# EAGLE schematic STM32-E407_Rev_B1 (EAGLE 9.6.2)
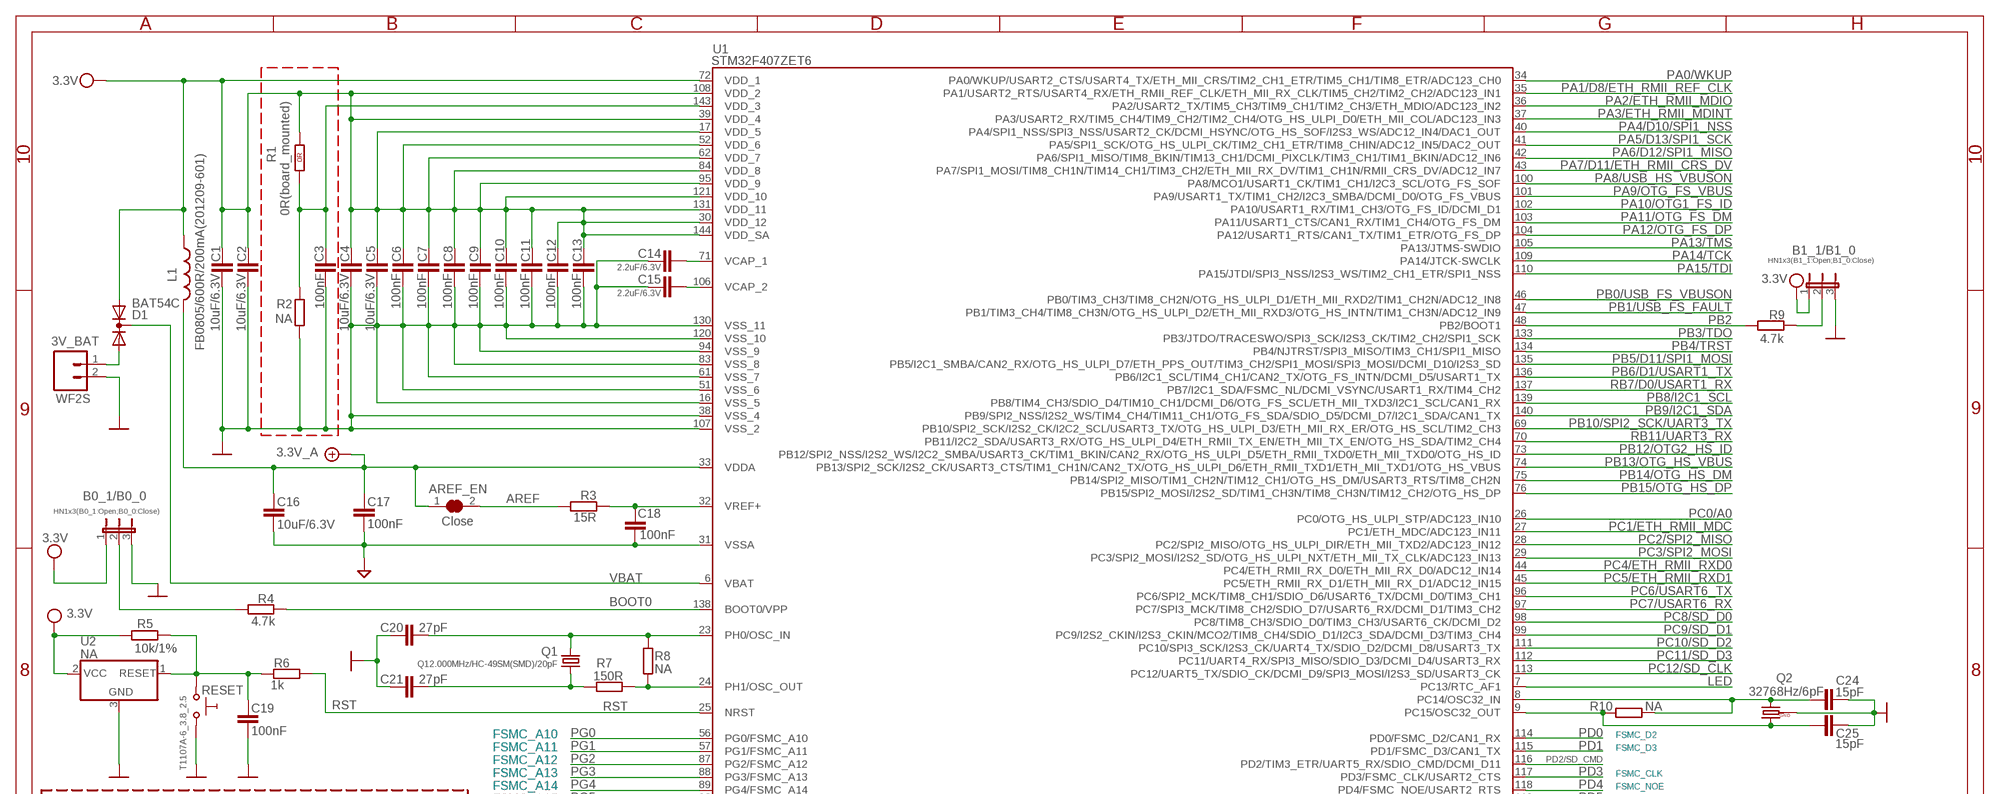
[diagram p0: schematic, sheet 1, part 1 of 2]
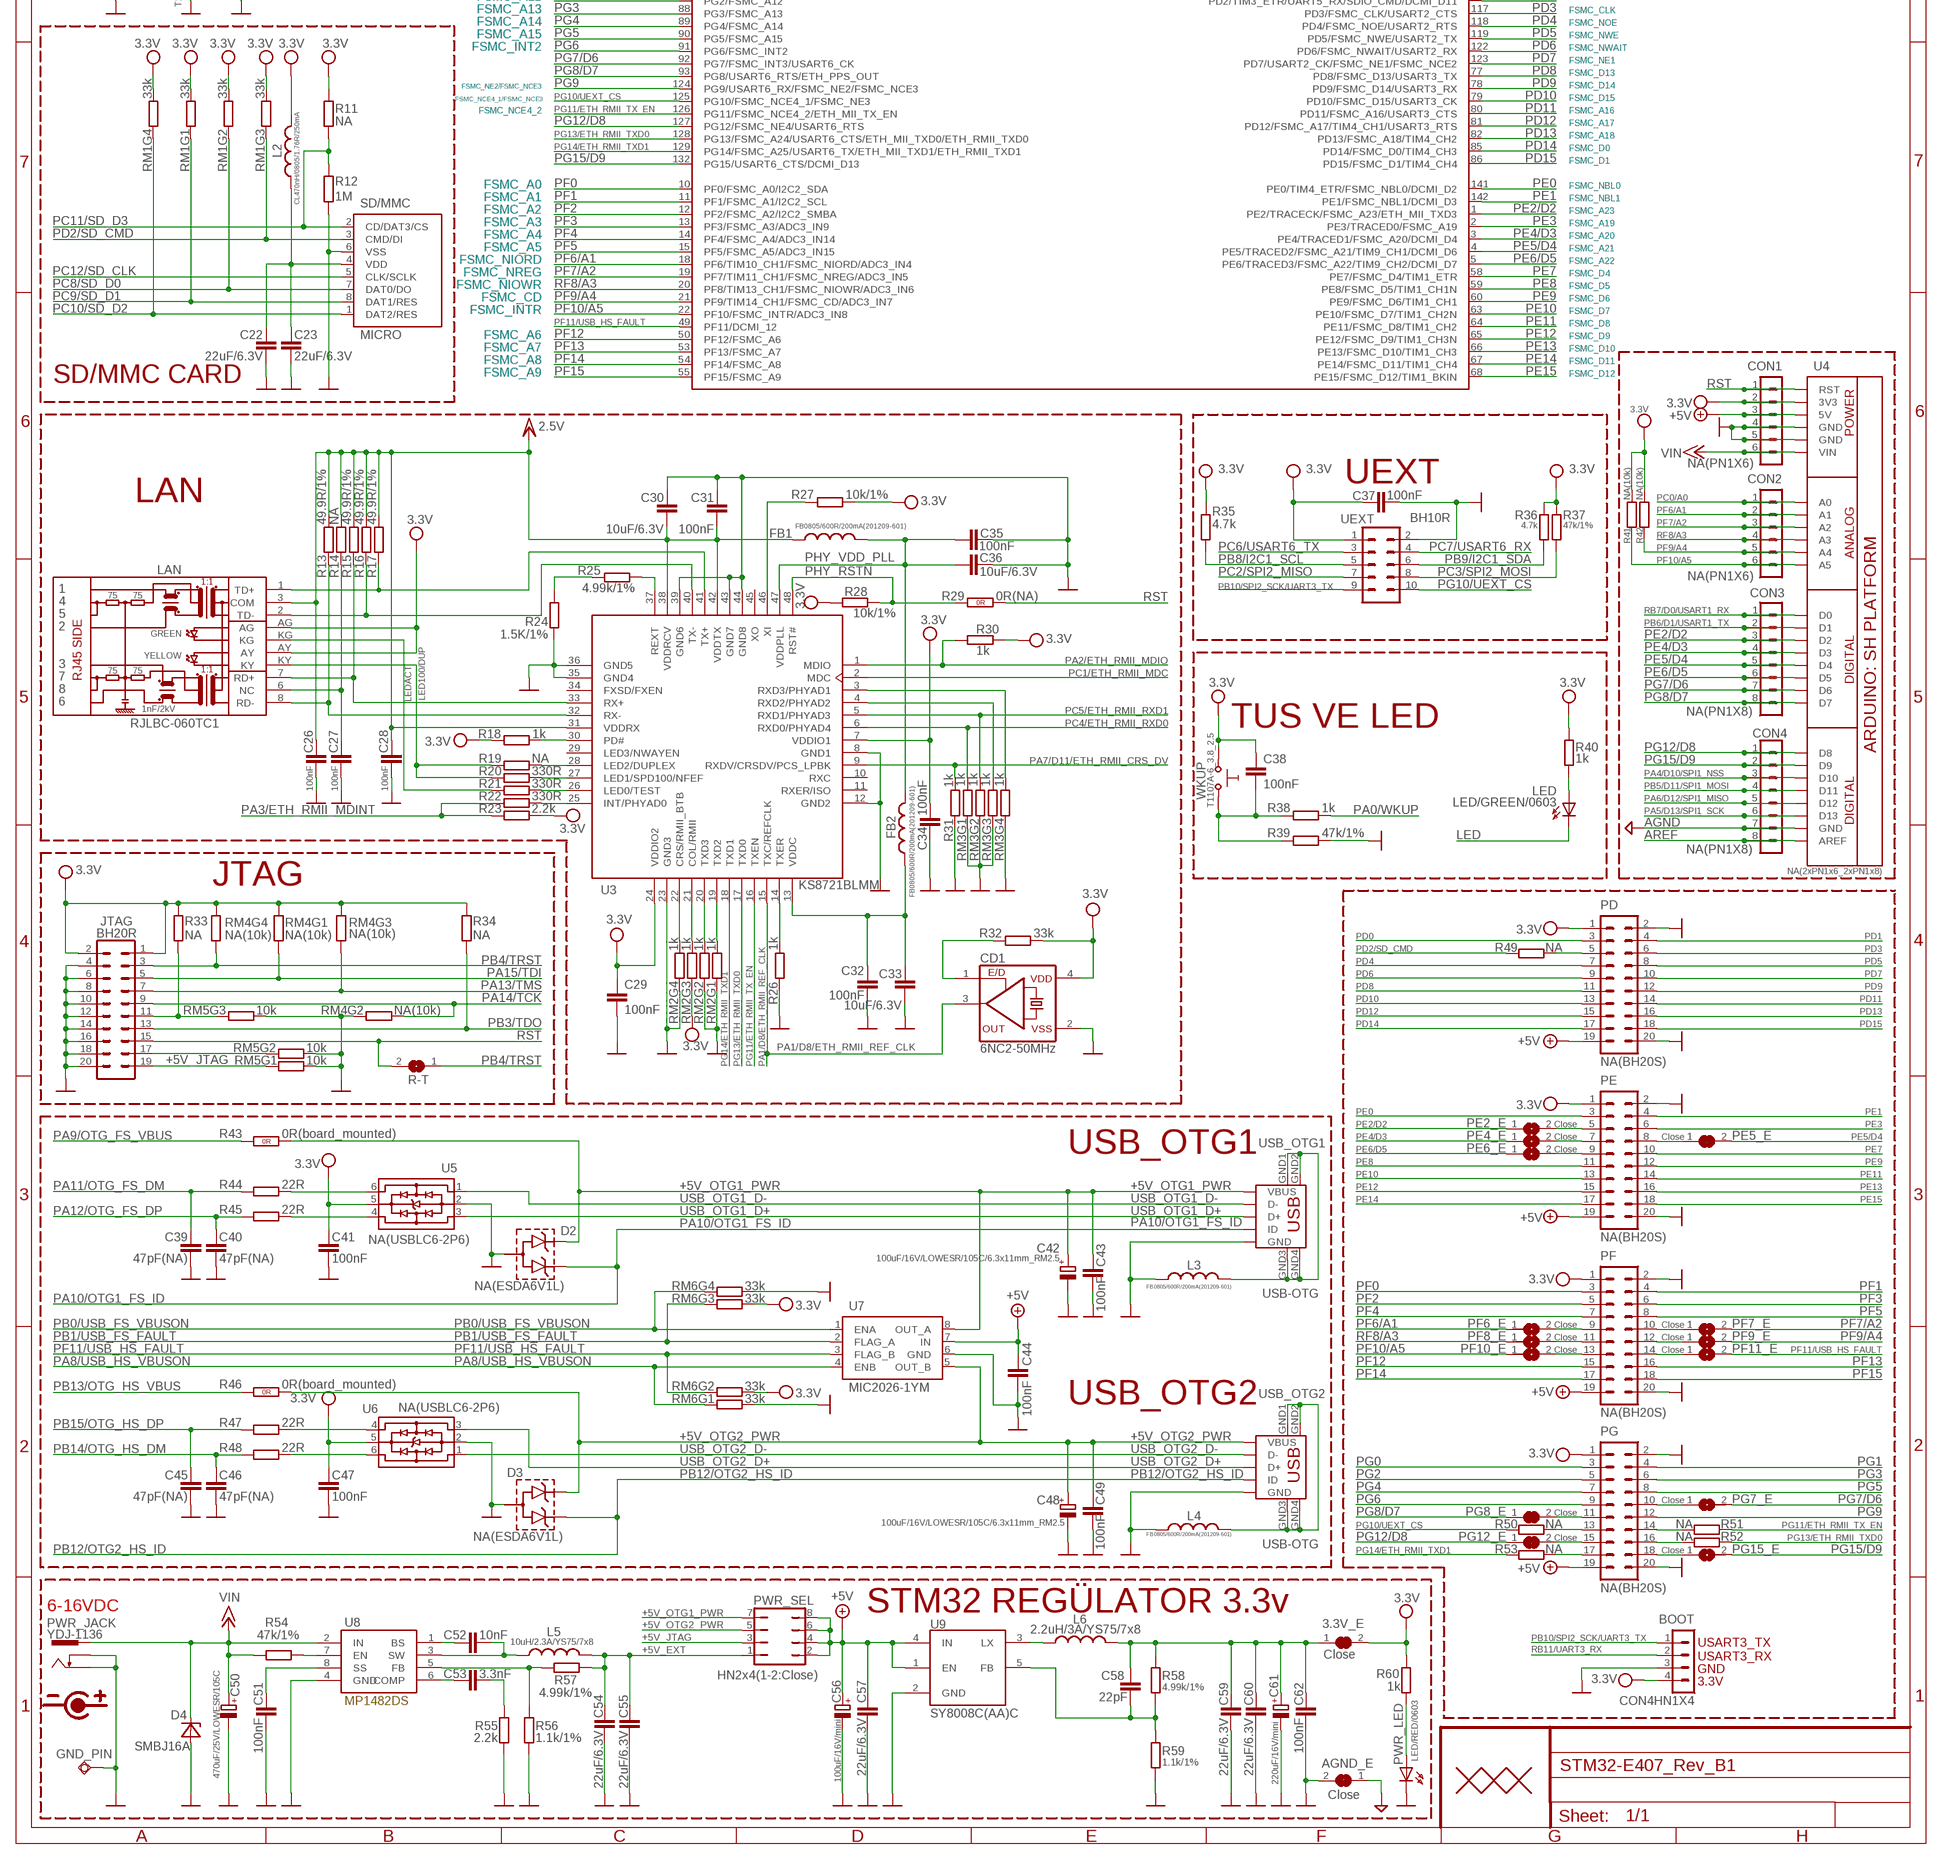
[diagram p1: schematic, sheet 1, part 2 of 2]

## Parts
3.3V_E  Close  SJSJ_1_SMALLER_CLOSE  [SJ_1_SMALLER_CLOSE]
3V_BAT  WF2S  CON2PV2-2.54MM  [CON2.54MM-2-0]
AGND_E  Close  SJSJ_1_SMALLER_CLOSE  [SJ_1_SMALLER_CLOSE]
AREF_EN  Close  SJSJ_1_SMALLER_CLOSE  [SJ_1_SMALLER_CLOSE]
B0_1/B0_0  HN1x3(B0_1:Open;B0_0:Close)  JP2E  [JP2]
B1_1/B1_0  HN1x3(B1_1:Open;B1_0:Close)  JP2E  [JP2]
BOOT  CON4HN1X4  [HN1X4]
C1  10uF/6.3V  C-EUC0603_DWS  [C0603_DWS]
C2  10uF/6.3V  C-EUC0603_DWS  [C0603_DWS]
C3  100nF  C-EUC0603_DWS  [C0603_DWS]
C4  10uF/6.3V  C-EUC0603_DWS  [C0603_DWS]
C5  10uF/6.3V  C-EUC0603_DWS  [C0603_DWS]
C6  100nF  C-EUC0603_DWS  [C0603_DWS]
C7  100nF  C-EUC0603_DWS  [C0603_DWS]
C8  100nF  C-EUC0603_DWS  [C0603_DWS]
C9  100nF  C-EUC0603_DWS  [C0603_DWS]
C10  100nF  C-EUC0603_DWS  [C0603_DWS]
C11  100nF  C-EUC0603_DWS  [C0603_DWS]
C12  100nF  C-EUC0603_DWS  [C0603_DWS]
C13  100nF  C-EUC0603_DWS  [C0603_DWS]
C14  2.2uF/6.3V  C-EUC0603_DWS  [C0603_DWS]
C15  2.2uF/6.3V  C-EUC0603_DWS  [C0603_DWS]
C16  10uF/6.3V  C-EUC0603_DWS  [C0603_DWS]
C17  100nF  C-EUC0603_DWS  [C0603_DWS]
C18  100nF  C-EUC0603_DWS  [C0603_DWS]
C19  100nF  C-EUC0603_DWS  [C0603_DWS]
C20  27pF  C-EUC0603_DWS  [C0603_DWS]
C21  27pF  C-EUC0603_DWS  [C0603_DWS]
C22  22uF/6.3V  C-EUC0603_DWS  [C0603_DWS]
C23  22uF/6.3V  C-EUC0603_DWS  [C0603_DWS]
C24  15pF  C-EUC0603_DWS  [C0603_DWS]
C25  15pF  C-EUC0603_DWS  [C0603_DWS]
C26  100nF  C-EUC0603_DWS  [C0603_DWS]
C27  100nF  C-EUC0603_DWS  [C0603_DWS]
C28  100nF  C-EUC0603_DWS  [C0603_DWS]
C29  100nF  C-EUC0603_DWS  [C0603_DWS]
C30  10uF/6.3V  C-EUC0603_DWS  [C0603_DWS]
C31  100nF  C-EUC0603_DWS  [C0603_DWS]
C32  100nF  C-EUC0603_DWS  [C0603_DWS]
C33  10uF/6.3V  C-EUC0603_DWS  [C0603_DWS]
C34  100nF  C-EUC0603_DWS  [C0603_DWS]
C35  100nF  C-EUC0603_DWS  [C0603_DWS]
C36  10uF/6.3V  C-EUC0603_DWS  [C0603_DWS]
C37  100nF  C-EUC0603_DWS  [C0603_DWS]
C38  100nF  C-EUC0603_DWS  [C0603_DWS]
C39  47pF(NA)  C-EUC0603_DWS  [C0603_DWS]
C40  47pF(NA)  C-EUC0603_DWS  [C0603_DWS]
C41  100nF  C-EUC0603_DWS  [C0603_DWS]
C42  100uF/16V/LOWESR/105C/6.3x11mm_RM2.5  CPOL-EUE2.5-6.3  [E2,5-6,3]
C43  100nF  C-EUC0603_DWS  [C0603_DWS]
C44  100nF  C-EUC0603_DWS  [C0603_DWS]
C45  47pF(NA)  C-EUC0603_DWS  [C0603_DWS]
C46  47pF(NA)  C-EUC0603_DWS  [C0603_DWS]
C47  100nF  C-EUC0603_DWS  [C0603_DWS]
C48  100uF/16V/LOWESR/105C/6.3x11mm_RM2.5  CPOL-EUE2.5-6.3  [E2,5-6,3]
C49  100nF  C-EUC0603_DWS  [C0603_DWS]
C50  470uF/25V/LOWESR/105C  CPOL-EUE5-10.5  [E5-10,5]
C51  100nF  C-EUC0603_DWS  [C0603_DWS]
C52  10nF  C-EUC0603_DWS  [C0603_DWS]
C53  3.3nF  C-EUC0603_DWS  [C0603_DWS]
C54  22uF/6.3V  C-EUC0603_DWS  [C0603_DWS]
C55  22uF/6.3V  C-EUC0603_DWS  [C0603_DWS]
C56  100uF/16V/mini  CPOL-EUE2.5-6  [E2,5-6]
C57  22uF/6.3V  C-EUC0603_DWS  [C0603_DWS]
C58  22pF  C-EUC0603_DWS  [C0603_DWS]
C59  22uF/6.3V  C-EUC0603_DWS  [C0603_DWS]
C60  22uF/6.3V  C-EUC0603_DWS  [C0603_DWS]
C61  220uF/16V/mini  CPOL-EUE3.5-8  [E3,5-8]
C62  100nF  C-EUC0603_DWS  [C0603_DWS]
CD1  6NC2-50MHz  6NC2_CLOCK_DRIVER  [7X5MM_CLOCK_DRIVER]
CON1  NA(PN1X6)  CON6PN1X6  [PN1X6]
CON2  NA(PN1X6)  CON6PN1X6  [PN1X6]
CON3  NA(PN1X8)  CON8PN1X8  [PN1X8]
CON4  NA(PN1X8)  CON8PN1X8  [PN1X8]
D1  BAT54C  DIODE_AC-CA_  [SOT23C]
D2  NA(ESDA6V1L)  MMBZ5V6ALT1  [SOT-23]
D3  NA(ESDA6V1L)  MMBZ5V6ALT1  [SOT-23]
D4  SMBJ16A  [DO214AA]
FB1  FB0805/600R/200mA(201209-601)  L-USL0805_5MIL_DWS  [L0805_5MIL_DWS]
FB2  FB0805/600R/200mA(201209-601)  L-USL0805_5MIL_DWS  [L0805_5MIL_DWS]
GND_PIN  TESTPAD3  [TEST_PAD40/70/SQUARE]
JTAG  BH20R  ML20R  [BH20R]
L1  FB0805/600R/200mA(201209-601)  L-USL0805_5MIL_DWS  [L0805_5MIL_DWS]
L2  CL470nH/0805/1.76R/250mA  L-USL0805_5MIL_DWS  [L0805_5MIL_DWS]
L3  FB0805/600R/200mA(201209-601)  L-USL0805_5MIL_DWS  [L0805_5MIL_DWS]
L4  FB0805/600R/200mA(201209-601)  L-USL0805_5MIL_DWS  [L0805_5MIL_DWS]
L5  10uH/2.3A/YS75/7x8  L-USL7078  [L7078]
L6  2.2uH/3A/YS75/7x8  L-USL7078  [L7078]
LAN  RJLBC-060TC1  [RJLBC-060TC1]
LED  LED/GREEN/0603  LED0603DWS  [LED-0603]
PD  NA(BH20S)  ML20  [ML20-MALE]
PE  NA(BH20S)  ML20  [ML20-MALE]
PE2_E  Close  SJSJ_1_SMALLER_CLOSE  [SJ_1_SMALLER_CLOSE]
PE4_E  Close  SJSJ_1_SMALLER_CLOSE  [SJ_1_SMALLER_CLOSE]
PE5_E  Close  SJSJ_1_SMALLER_CLOSE  [SJ_1_SMALLER_CLOSE]
PE6_E  Close  SJSJ_1_SMALLER_CLOSE  [SJ_1_SMALLER_CLOSE]
PF  NA(BH20S)  ML20  [ML20-MALE]
PF6_E  Close  SJSJ_1_SMALLER_CLOSE  [SJ_1_SMALLER_CLOSE]
PF7_E  Close  SJSJ_1_SMALLER_CLOSE  [SJ_1_SMALLER_CLOSE]
PF8_E  Close  SJSJ_1_SMALLER_CLOSE  [SJ_1_SMALLER_CLOSE]
PF9_E  Close  SJSJ_1_SMALLER_CLOSE  [SJ_1_SMALLER_CLOSE]
PF10_E  Close  SJSJ_1_SMALLER_CLOSE  [SJ_1_SMALLER_CLOSE]
PF11_E  Close  SJSJ_1_SMALLER_CLOSE  [SJ_1_SMALLER_CLOSE]
PG  NA(BH20S)  ML20  [ML20-MALE]
PG7_E  Close  SJSJ_1_SMALLER_CLOSE  [SJ_1_SMALLER_CLOSE]
PG8_E  Close  SJSJ_1_SMALLER_CLOSE  [SJ_1_SMALLER_CLOSE]
PG12_E  Close  SJSJ_1_SMALLER_CLOSE  [SJ_1_SMALLER_CLOSE]
PG15_E  Close  SJSJ_1_SMALLER_CLOSE  [SJ_1_SMALLER_CLOSE]
PWR_JACK  YDJ-1136  PWR-JAKPWR_JACK_UNI_MILLING  [PWR_JACK_UNI_MILLING]
PWR_LED  LED/RED/0603  LED0603DWS  [LED-0603]
PWR_SEL  HN2x4(1-2:Close)  JP4QNEW  [JP4Q_2]
Q1  Q12.000MHz/HC-49SM(SMD)/20pF  HC49/S1  [HC49/SMD2_THIN]
Q2  32768Hz/6pF  Q_GND1  [TC26H_3_REPAIR_SMD]
R1  0R(board_mounted)  R_0R0R(NA)  [0603_0R]
R2  NA  R-EU_R0603_5MIL_DWS_NA  [R0603_5MIL_DWS_NA]
R3  15R  R-EU_R0603_5MIL_DWS  [R0603_5MIL_DWS]
R4  4.7k  R-EU_R0603_5MIL_DWS  [R0603_5MIL_DWS]
R5  10k/1%  R-EU_R0603_5MIL_DWS  [R0603_5MIL_DWS]
R6  1k  R-EU_R0603_5MIL_DWS  [R0603_5MIL_DWS]
R7  150R  R-EU_R0603_5MIL_DWS  [R0603_5MIL_DWS]
R8  NA  R-EU_R0603_5MIL_DWS_NA  [R0603_5MIL_DWS_NA]
R9  4.7k  R-EU_R0603_5MIL_DWS  [R0603_5MIL_DWS]
R10  NA  R-EU_R0603_5MIL_DWS_NA  [R0603_5MIL_DWS_NA]
R11  NA  R-EU_R0603_5MIL_DWS_NA  [R0603_5MIL_DWS_NA]
R12  1M  R-EU_R0603_5MIL_DWS  [R0603_5MIL_DWS]
R13  49.9R/1%  R-EU_R0603_5MIL_DWS  [R0603_5MIL_DWS]
R14  NA  R-EU_R0603_5MIL_DWS_NA  [R0603_5MIL_DWS_NA]
R15  49.9R/1%  R-EU_R0603_5MIL_DWS  [R0603_5MIL_DWS]
R16  49.9R/1%  R-EU_R0603_5MIL_DWS  [R0603_5MIL_DWS]
R17  49.9R/1%  R-EU_R0603_5MIL_DWS  [R0603_5MIL_DWS]
R18  1k  R-EU_R0603_5MIL_DWS  [R0603_5MIL_DWS]
R19  NA  R-EU_R0603_5MIL_DWS_NA  [R0603_5MIL_DWS_NA]
R20  330R  R-EU_R0603_5MIL_DWS  [R0603_5MIL_DWS]
R21  330R  R-EU_R0603_5MIL_DWS  [R0603_5MIL_DWS]
R22  330R  R-EU_R0603_5MIL_DWS  [R0603_5MIL_DWS]
R23  2.2k  R-EU_R0603_5MIL_DWS  [R0603_5MIL_DWS]
R24  1.5K/1%  R-EU_R0603_5MIL_DWS  [R0603_5MIL_DWS]
R25  4.99k/1%  R-EU_R0603_5MIL_DWS  [R0603_5MIL_DWS]
R26  1k  R-EU_R0603_5MIL_DWS  [R0603_5MIL_DWS]
R27  10k/1%  R-EU_R0603_5MIL_DWS  [R0603_5MIL_DWS]
R28  10k/1%  R-EU_R0603_5MIL_DWS  [R0603_5MIL_DWS]
R29  0R(NA)  R_0R0R(NA)  [0603_0R]
R30  1k  R-EU_R0603_5MIL_DWS  [R0603_5MIL_DWS]
R31  1k  R-EU_R0603_5MIL_DWS  [R0603_5MIL_DWS]
R32  33k  R-EU_R0603_5MIL_DWS  [R0603_5MIL_DWS]
R33  NA  R-EU_R0603_5MIL_DWS_NA  [R0603_5MIL_DWS_NA]
R34  NA  R-EU_R0603_5MIL_DWS_NA  [R0603_5MIL_DWS_NA]
R35  4.7k  R-EU_R0603_5MIL_DWS  [R0603_5MIL_DWS]
R36  4.7k  R-EU_R0603_5MIL_DWS  [R0603_5MIL_DWS]
R37  47k/1%  R-EU_R0603_5MIL_DWS  [R0603_5MIL_DWS]
R38  1k  R-EU_R0603_5MIL_DWS  [R0603_5MIL_DWS]
R39  47k/1%  R-EU_R0603_5MIL_DWS  [R0603_5MIL_DWS]
R40  1k  R-EU_R0603_5MIL_DWS  [R0603_5MIL_DWS]
R41  NA(10k)  R-EU_R0603_5MIL_DWS_NA  [R0603_5MIL_DWS_NA]
R42  NA(10k)  R-EU_R0603_5MIL_DWS_NA  [R0603_5MIL_DWS_NA]
R43  0R(board_mounted)  R_0R0R(NA)  [0603_0R]
R44  22R  R-EU_R0603_5MIL_DWS  [R0603_5MIL_DWS]
R45  22R  R-EU_R0603_5MIL_DWS  [R0603_5MIL_DWS]
R46  0R(board_mounted)  R_0R0R(NA)  [0603_0R]
R47  22R  R-EU_R0603_5MIL_DWS  [R0603_5MIL_DWS]
R48  22R  R-EU_R0603_5MIL_DWS  [R0603_5MIL_DWS]
R49  NA  R-EU_R0603_5MIL_DWS  [R0603_5MIL_DWS]
R50  NA  R-EU_R0603_5MIL_DWS  [R0603_5MIL_DWS]
R51  NA  R-EU_R0603_5MIL_DWS  [R0603_5MIL_DWS]
R52  NA  R-EU_R0603_5MIL_DWS  [R0603_5MIL_DWS]
R53  NA  R-EU_R0603_5MIL_DWS  [R0603_5MIL_DWS]
R54  47k/1%  R-EU_R0603_5MIL_DWS  [R0603_5MIL_DWS]
R55  2.2k  R-EU_R0603_5MIL_DWS  [R0603_5MIL_DWS]
R56  1.1k/1%  R-EU_R0603_5MIL_DWS  [R0603_5MIL_DWS]
R57  4.99k/1%  R-EU_R0603_5MIL_DWS  [R0603_5MIL_DWS]
R58  4.99k/1%  R-EU_R0603_5MIL_DWS  [R0603_5MIL_DWS]
R59  1.1k/1%  R-EU_R0603_5MIL_DWS  [R0603_5MIL_DWS]
R60  1k  R-EU_R0603_5MIL_DWS  [R0603_5MIL_DWS]
R-T  Open  SJSJ_SMALLER  [SJ_1_SMALLER]
RESET  T1107A-6_3.8_2.5  SW-TAKT6  [SW-TAKT_6X3.5_SMD]
RM1  33k  R_MATRIX_4E  [R_MATRIX_4]
RM2  1k  R_MATRIX_4E  [R_MATRIX_4]
RM3  1k  R_MATRIX_4E  [R_MATRIX_4]
RM4  NA(10k)  R_MATRIX_4E  [R_MATRIX_4]
RM5  10k  R_MATRIX_4E  [R_MATRIX_4]
RM6  33k  R_MATRIX_4E  [R_MATRIX_4]
SD/MMC  MICRO  MICRO_SD/MMC  [TFR-MEM-CON]
U1  STM32F407ZET6  STM32F207ZET6  [LQFP144]
U2  NA  RESETMCP130T-300-I/TT  [SOT23]
U3  KS8721BLMM  [LQFP48_MM]
U4  NA(2xPN1x6_2xPN1x8)  ARDUINO_SH_PLATFORM3  [ARDUINO_SHIELD_PLATFORM_WITHOUT_DIMENSION]
U5  NA(USBLC6-2P6)  USBLC6-2  [USBLC6-2P6]
U6  NA(USBLC6-2P6)  USBLC6-2  [USBLC6-2P6]
U7  MIC2026-1YM  [SO-8]
U8  MP1482DS  MP1482  [SOIC8]
U9  SY8008C(AA)C  SY8008  [SOT23-5]
U$1  FIDUCIAL1X2  [FIDUCIAL-1X2]
U$2  FIDUCIAL1X2  [FIDUCIAL-1X2]
U$9  FIDUCIAL1X2  [FIDUCIAL-1X2]
UEXT  BH10R  ML10R  [BH10R]
USB_OTG1  USB-OTG  MINI_USB9  [USB_MINI_9PIN]
USB_OTG2  USB-OTG  MINI_USB9  [USB_MINI_9PIN]
WKUP  T1107A-6_3.8_2.5  SW-TAKT6  [SW-TAKT_6X3.5_SMD]

## Nets
+5V: C44.1 C56.+ C57.1 CON1.3 PD.19 PE.19 PF.19 PG.19 PWR_SEL.2 PWR_SEL.4 PWR_SEL.6 PWR_SEL.8 U4.5V U7.7(IN) U9.1(EN) U9.4(IN)
+5V_EXT: C54.1 C55.1 L5.2 PWR_SEL.1 R57.2
+5V_JTAG: JTAG.19 PWR_SEL.3 RM5.1.1
+5V_OTG1_PWR: C42.+ C43.1 D2.1 PWR_SEL.7 R43.2(1.2) U7.8(OUT_A) USB_OTG1.VBUS
+5V_OTG2_PWR: C48.+ C49.1 D3.1 PWR_SEL.5 R46.2(1.2) U7.5(OUT_B) USB_OTG2.VBUS
+7V: AREF_EN.1 C16.1 C17.2 L1.2 U1.33(VDDA) ; supply symbol labelled 3.3V_A
+15V: C50.+ CON1.6 D4.C PWR_JACK.+ R54.1 U4.VIN U8.2(IN) ; supply symbol labelled VIN
AGND: AGND_E.1 C16.2 C17.1 C18.1 CON4.7 U1.31(VSSA) U4.GND@2(GND)
AREF: AREF_EN.2 CON4.8 R3.1 U4.AREF
BOOT0: R4.1 U1.138(BOOT0/VPP)
GND [PWR]: 3V_BAT.2 AGND_E.2 B0_1/B0_0.3 B1_1/B1_0.3 BOOT.3 C1.1 C2.1 C3.1 C4.1 C5.1 C6.1 C7.1 C8.1 C9.1 C10.1 C11.1 C12.1 C13.1 C14.1 C15.1 C19.1 C20.2 C21.2 C22.2 C23.2 C24.2 C25.2 C26.2 C27.1 C28.2 C29.2 C30.1 C31.1 C32.2 C33.2 C34.2 C35.2 C36.2 C37.1 C39.2 C40.2 C41.1 C42.- C43.2 C44.2 C45.2 C46.2 C47.1 C48.- C49.2 C50.- C51.2 C54.2 C55.2 C56.- C57.2 C59.2 C60.2 C61.- C62.2 CD1.2(VSS) CON1.4 CON1.5 D2.3 D3.3 D4.A GND_PIN.P$1(PP) JTAG.4 JTAG.6 JTAG.8 JTAG.10 JTAG.12 JTAG.14 JTAG.16 JTAG.18 JTAG.20 L3.1 L4.1 PD.2 PD.20 PE.2 PE.20 PF.2 PF.20 PG.2 PG.20 PWR_JACK.- PWR_JACK.-- PWR_LED.C Q2.GND R2.2 R12.2 R24.2 R26.2 R31.2 R39.1 R55.2 R56.2 R59.2 RESET.P$2 RM2.1.1 RM2.2.1 RM2.4.1 RM3.1.2 RM3.2.2 RM3.3.2 RM3.4.2 RM4.2.1 RM5.1.2 RM5.2.2 RM5.3.2 RM6.1.2 RM6.4.2 SD/MMC.6(VSS) U1.16(VSS_5) U1.38(VSS_4) U1.51(VSS_6) U1.61(VSS_7) U1.83(VSS_8) U1.94(VSS_9) U1.107(VSS_2) U1.120(VSS_10) U1.130(VSS_11) U2.3(GND) U3.8(GND1) U3.12(GND2) U3.23(GND3) U3.35(GND4) U3.36(GND5) U3.39(GND6) U3.43(GND7) U3.44(GND8) U4.GND U4.GND@1(GND) U5.2 U6.2 U7.6(GND) U8.4(GND) U9.2(GND) UEXT.2 USB_OTG1.GND USB_OTG2.GND
LED: LED.C U1.7(PC13/RTC_AF1)
LED100/DUP: LAN.KY R19.1 R20.1
LEDACT: LAN.KG R21.1
N$1: C20.1 Q1.2 R8.2 U1.23(PH0/OSC_IN)
N$2: C21.1 Q1.1 R7.1
N$3: R7.2 R8.1 U1.24(PH1/OSC_OUT)
N$4: JTAG.17 RM5.2.1
N$5: LED.A R40.1
N$6: PD.5 R49.1
N$7: R24.1 R25.1
N$8: C58.2 R58.2 R59.1 U9.5(FB)
N$9: B0_1/B0_0.2 R4.2
N$10 [PWR]: 3.3V_E.1 C58.1 C59.1 C60.1 C61.+ C62.1 L6.2 R58.1
N$11: C32.1 C33.1 FB2.2 U3.13(VDDC)
N$12: PG.14 R51.2
N$13: PF10_E.2 PF.13
N$14: PG.16 R52.2
N$15: PF6_E.2 PF.9
N$16: PF8_E.2 PF.11
N$17: PF7_E.1 PF.10
N$18: PG.17 R53.1
N$19: PF9_E.1 PF.12
N$21: LAN.2(TD-) R16.1 U3.40(TX-)
N$22: LAN.1(TD+) R17.1 U3.41(TX+)
N$23: R26.1 U3.14(TXER)
N$24: PG7_E.1 PG.10
N$25: C38.1 R38.1 R39.2 WKUP.P$2
N$26: PE5_E.1 PE.8
N$27: PE6_E.2 PE.9
N$28: PE4_E.2 PE.7
N$29: B1_1/B1_0.2 R9.2
N$30: PE2_E.2 PE.5
N$32: PG8_E.2 PG.11
N$33: LAN.7(RD+) R15.1 U3.33(RX+)
N$34: PG12_E.2 PG.15
N$35: PG15_E.1 PG.18
N$36: C51.1 U8.8(SS)
N$37: R54.2 U8.7(EN)
N$38: PG.13 R50.1
N$39: PF11_E.1 PF.14
N$40: R20.2 U3.27(LED1/SPD100/NFEF)
N$43: R47.2 U6.4
N$45: R21.2 U3.26(LED0/TEST)
N$46: C52.1 U8.1(BS)
N$47: R48.2 U6.6
N$48: R18.2 U3.30(PD#)
N$50: C52.2 L5.1 U8.3(SW)
N$51: R44.2 U5.6
N$52: R45.2 U5.4
N$60: C53.1 U8.6(COMP)
N$61: C53.2 R55.1
N$62: R56.1 R57.1 U8.5(FB)
N$64: L6.1 U9.3(LX)
N$68: R19.2 U3.28(LED2/DUPLEX)
N$71: R25.2 U3.37(REXT)
N$75: 3V_BAT.1 D1.2(A2)
N$78: C22.1 C23.1 L2.2 SD/MMC.4(VDD)
N$79: C27.2 LAN.6(NC) R14.1
N$82: LAN.8(RD-) R13.1 U3.32(RX-)
N$85: JTAG.11 R33.1 RM5.3.1
N$98: RM2.3.2 U3.21(COL/RMII)
N$114: RM2.4.2 U3.22(CRS/RMII_BTB)
N$115: RM3.3.1 U3.4(RXD2/PHYAD2)
N$116: RM3.4.1 U3.3(RXD3/PHYAD1)
N$117: C14.2 U1.71(VCAP_1)
N$119: CD1.1(E/D) R32.2
N$121: R22.2 U3.25(INT/PHYAD0)
N$122: R27.2 U3.46(XI)
N$123: RM2.1.2 U3.19(TXD2)
N$125: RM2.2.2 U3.20(TXD3)
N$128: C15.2 U1.106(VCAP_2)
N$129: PWR_LED.A R60.2
N$163: C19.2 R5.1 R6.2 RESET.P$1 U2.1(RESET)
N$470: C3.2 R1.1(1.1) R2.1 U1.143(VDD_3)
PA0/WKUP: R38.2 U1.34(PA0/WKUP/USART2_CTS/USART4_TX/ETH_MII_CRS/TIM2_CH1_ETR/TIM5_CH1/TIM8_ETR/ADC123_CH0)
PA1/D8/ETH_RMII_REF_CLK: CD1.3(OUT) U1.35(PA1/USART2_RTS/USART4_RX/ETH_RMII_REF_CLK/ETH_MII_RX_CLK/TIM5_CH2/TIM2_CH2/ADC123_IN1) U3.15(TXC/REFCLK)
PA2/ETH_RMII_MDIO [thin]: R30.2 U1.36(PA2/USART2_TX/TIM5_CH3/TIM9_CH1/TIM2_CH3/ETH_MDIO/ADC123_IN2) U3.1(MDIO)
PA3/ETH_RMII_MDINT: R22.1 R23.1 U1.37(PA3/USART2_RX/TIM5_CH4/TIM9_CH2/TIM2_CH4/OTG_HS_ULPI_D0/ETH_MII_COL/ADC123_IN3)
PA4/D10/SPI1_NSS: CON4.3 U1.40(PA4/SPI1_NSS/SPI3_NSS/USART2_CK/DCMI_HSYNC/OTG_HS_SOF/I2S3_WS/ADC12_IN4/DAC1_OUT) U4.D10
PA5/D13/SPI1_SCK: CON4.6 U1.41(PA5/SPI1_SCK/OTG_HS_ULPI_CK/TIM2_CH1_ETR/TIM8_CHIN/ADC12_IN5/DAC2_OUT) U4.D13
PA6/D12/SPI1_MISO: CON4.5 U1.42(PA6/SPI1_MISO/TIM8_BKIN/TIM13_CH1/DCMI_PIXCLK/TIM3_CH1/TIM1_BKIN/ADC12_IN6) U4.D12
PA7/D11/ETH_RMII_CRS_DV: R31.1 U1.43(PA7/SPI1_MOSI/TIM8_CH1N/TIM14_CH1/TIM3_CH2/ETH_MII_RX_DV/TIM1_CH1N/RMII_CRS_DV/ADC12_IN7) U3.9(RXDV/CRSDV/PCS_LPBK)
PA8/USB_HS_VBUSON: RM6.1.1 U1.100(PA8/MCO1/USART1_CK/TIM1_CH1/I2C3_SCL/OTG_FS_SOF) U7.4(ENB)
PA9/OTG_FS_VBUS: R43.1(1.1) U1.101(PA9/USART1_TX/TIM1_CH2/I2C3_SMBA/DCMI_D0/OTG_FS_VBUS)
PA10/OTG1_FS_ID: D2.2 U1.102(PA10/USART1_RX/TIM1_CH3/OTG_FS_ID/DCMI_D1) USB_OTG1.ID
PA11/OTG_FS_DM: C39.1 R44.1 U1.103(PA11/USART1_CTS/CAN1_RX/TIM1_CH4/OTG_FS_DM)
PA12/OTG_FS_DP: C40.1 R45.1 U1.104(PA12/USART1_RTS/CAN1_TX/TIM1_ETR/OTG_FS_DP)
PA13/TMS: JTAG.7 RM4.3.1 U1.105(PA13/JTMS-SWDIO)
PA14/TCK: JTAG.9 RM4.2.2 U1.109(PA14/JTCK-SWCLK)
PA15/TDI: JTAG.5 RM4.1.1 U1.110(PA15/JTDI/SPI3_NSS/I2S3_WS/TIM2_CH1_ETR/SPI1_NSS)
PB0/USB_FS_VBUSON: RM6.4.1 U1.46(PB0/TIM3_CH3/TIM8_CH2N/OTG_HS_ULPI_D1/ETH_MII_RXD2/TIM1_CH2N/ADC12_IN8) U7.1(ENA)
PB1/USB_FS_FAULT: RM6.3.1 U1.47(PB1/TIM3_CH4/TIM8_CH3N/OTG_HS_ULPI_D2/ETH_MII_RXD3/OTG_HS_INTN/TIM1_CH3N/ADC12_IN9) U7.2(FLAG_A)
PB2: R9.1 U1.48(PB2/BOOT1)
PB3/TDO: JTAG.13 R34.1 U1.133(PB3/JTDO/TRACESWO/SPI3_SCK/I2S3_CK/TIM2_CH2/SPI1_SCK)
PB4/TRST: JTAG.3 R-T.1 RM4.4.1 U1.134(PB4/NJTRST/SPI3_MISO/TIM3_CH1/SPI1_MISO)
PB5/D11/SPI1_MOSI: CON4.4 U1.135(PB5/I2C1_SMBA/CAN2_RX/OTG_HS_ULPI_D7/ETH_PPS_OUT/TIM3_CH2/SPI1_MOSI/SPI3_MOSI/DCMI_D10/I2S3_SD) U4.D11
PB6/D1/USART1_TX: CON3.2 U1.136(PB6/I2C1_SCL/TIM4_CH1/CAN2_TX/OTG_FS_INTN/DCMI_D5/USART1_TX) U4.D1
PB8/I2C1_SCL: R35.1 U1.139(PB8/TIM4_CH3/SDIO_D4/TIM10_CH1/DCMI_D6/OTG_FS_SCL/ETH_MII_TXD3/I2C1_SCL/CAN1_RX) UEXT.5
PB9/I2C1_SDA: R36.1 U1.140(PB9/SPI2_NSS/I2S2_WS/TIM4_CH4/TIM11_CH1/OTG_FS_SDA/SDIO_D5/DCMI_D7/I2C1_SDA/CAN1_TX) UEXT.6
PB10/SPI2_SCK/UART3_TX: BOOT.1 U1.69(PB10/SPI2_SCK/I2S2_CK/I2C2_SCL/USART3_TX/OTG_HS_ULPI_D3/ETH_MII_RX_ER/OTG_HS_SCL/TIM2_CH3) UEXT.9
PB12/OTG2_HS_ID: D3.2 U1.73(PB12/SPI2_NSS/I2S2_WS/I2C2_SMBA/USART3_CK/TIM1_BKIN/CAN2_RX/OTG_HS_ULPI_D5/ETH_RMII_TXD0/ETH_MII_TXD0/OTG_HS_ID) USB_OTG2.ID
PB13/OTG_HS_VBUS: R46.1(1.1) U1.74(PB13/SPI2_SCK/I2S2_CK/USART3_CTS/TIM1_CH1N/CAN2_TX/OTG_HS_ULPI_D6/ETH_RMII_TXD1/ETH_MII_TXD1/OTG_HS_VBUS)
PB14/OTG_HS_DM: C46.1 R48.1 U1.75(PB14/SPI2_MISO/TIM1_CH2N/TIM12_CH1/OTG_HS_DM/USART3_RTS/TIM8_CH2N)
PB15/OTG_HS_DP: C45.1 R47.1 U1.76(PB15/SPI2_MOSI/I2S2_SD/TIM1_CH3N/TIM8_CH3N/TIM12_CH2/OTG_HS_DP)
PC0/A0: CON2.1 U1.26(PC0/OTG_HS_ULPI_STP/ADC123_IN10) U4.A0
PC1/ETH_RMII_MDC: U1.27(PC1/ETH_MDC/ADC123_IN11) U3.2(MDC)
PC2/SPI2_MISO: U1.28(PC2/SPI2_MISO/OTG_HS_ULPI_DIR/ETH_MII_TXD2/ADC123_IN12) UEXT.7
PC3/SPI2_MOSI: R37.1 U1.29(PC3/SPI2_MOSI/I2S2_SD/OTG_HS_ULPI_NXT/ETH_MII_TX_CLK/ADC123_IN13) UEXT.8
PC4/ETH_RMII_RXD0: RM3.1.1 U1.44(PC4/ETH_RMII_RX_D0/ETH_MII_RX_D0/ADC12_IN14) U3.6(RXD0/PHYAD4)
PC5/ETH_RMII_RXD1: RM3.2.1 U1.45(PC5/ETH_RMII_RX_D1/ETH_MII_RX_D1/ADC12_IN15) U3.5(RXD1/PHYAD3)
PC6/USART6_TX: U1.96(PC6/SPI2_MCK/TIM8_CH1/SDIO_D6/USART6_TX/DCMI_D0/TIM3_CH1) UEXT.3
PC7/USART6_RX: U1.97(PC7/SPI3_MCK/TIM8_CH2/SDIO_D7/USART6_RX/DCMI_D1/TIM3_CH2) UEXT.4
PC8/SD_D0: RM1.2.1 SD/MMC.7(DAT0/DO) U1.98(PC8/TIM8_CH3/SDIO_D0/TIM3_CH3/USART6_CK/DCMI_D2)
PC9/SD_D1: RM1.1.1 SD/MMC.8(DAT1/RES) U1.99(PC9/I2S2_CKIN/I2S3_CKIN/MCO2/TIM8_CH4/SDIO_D1/I2C3_SDA/DCMI_D3/TIM3_CH4)
PC10/SD_D2: RM1.4.1 SD/MMC.1(DAT2/RES) U1.111(PC10/SPI3_SCK/I2S3_CK/UART4_TX/SDIO_D2/DCMI_D8/USART3_TX)
PC11/SD_D3: R11.2 R12.1 SD/MMC.2(CD/DAT3/CS) U1.112(PC11/UART4_RX/SPI3_MISO/SDIO_D3/DCMI_D4/USART3_RX)
PC12/SD_CLK: SD/MMC.5(CLK/SCLK) U1.113(PC12/UART5_TX/SDIO_CK/DCMI_D9/SPI3_MOSI/I2S3_SD/USART3_CK)
PC14: C24.1 Q2.2 R10.2 U1.8(PC14/OSC32_IN)
PC15: C25.1 Q2.1 R10.1 U1.9(PC15/OSC32_OUT)
PD0: PD.3 U1.114(PD0/FSMC_D2/CAN1_RX)
PD1: PD.4 U1.115(PD1/FSMC_D3/CAN1_TX)
PD2/SD_CMD: R49.2 RM1.3.1 SD/MMC.3(CMD/DI) U1.116(PD2/TIM3_ETR/UART5_RX/SDIO_CMD/DCMI_D11)
PD3: PD.6 U1.117(PD3/FSMC_CLK/USART2_CTS)
PD4: PD.7 U1.118(PD4/FSMC_NOE/USART2_RTS)
PD5: PD.8 U1.119(PD5/FSMC_NWE/USART2_TX)
PD6: PD.9 U1.122(PD6/FSMC_NWAIT/USART2_RX)
PD7: PD.10 U1.123(PD7/USART2_CK/FSMC_NE1/FSMC_NCE2)
PD8 [thin]: PD.11 U1.77(PD8/FSMC_D13/USART3_TX)
PD9: PD.12 U1.78(PD9/FSMC_D14/USART3_RX)
PD10: PD.13 U1.79(PD10/FSMC_D15/USART3_CK)
PD11 [thin]: PD.14 U1.80(PD11/FSMC_A16/USART3_CTS)
PD12 [thin]: PD.15 U1.81(PD12/FSMC_A17/TIM4_CH1/USART3_RTS)
PD13: PD.16 U1.82(PD13/FSMC_A18/TIM4_CH2)
PD14: PD.17 U1.85(PD14/FSMC_D0/TIM4_CH3)
PD15 [thin]: PD.18 U1.86(PD15/FSMC_D1/TIM4_CH4)
PE0: PE.3 U1.141(PE0/TIM4_ETR/FSMC_NBL0/DCMI_D2)
PE1 [thin]: PE.4 U1.142(PE1/FSMC_NBL1/DCMI_D3)
PE2/D2: CON3.3 PE2_E.1 U1.1(PE2/TRACECK/FSMC_A23/ETH_MII_TXD3) U4.D2
PE3: PE.6 U1.2(PE3/TRACED0/FSMC_A19)
PE4/D3: CON3.4 PE4_E.1 U1.3(PE4/TRACED1/FSMC_A20/DCMI_D4) U4.D3
PE5/D4: CON3.5 PE5_E.2 U1.4(PE5/TRACED2/FSMC_A21/TIM9_CH1/DCMI_D6) U4.D4
PE6/D5: CON3.6 PE6_E.1 U1.5(PE6/TRACED3/FSMC_A22/TIM9_CH2/DCMI_D7) U4.D5
PE7 [thin]: PE.10 U1.58(PE7/FSMC_D4/TIM1_ETR)
PE8 [thin]: PE.11 U1.59(PE8/FSMC_D5/TIM1_CH1N)
PE9: PE.12 U1.60(PE9/FSMC_D6/TIM1_CH1)
PE10: PE.13 U1.63(PE10/FSMC_D7/TIM1_CH2N)
PE11: PE.14 U1.64(PE11/FSMC_D8/TIM1_CH2)
PE12: PE.15 U1.65(PE12/FSMC_D9/TIM1_CH3N)
PE13 [thin]: PE.16 U1.66(PE13/FSMC_D10/TIM1_CH3)
PE14 [thin]: PE.17 U1.67(PE14/FSMC_D11/TIM1_CH4)
PE15 [thin]: PE.18 U1.68(PE15/FSMC_D12/TIM1_BKIN)
PF0: PF.3 U1.10(PF0/FSMC_A0/I2C2_SDA)
PF1: PF.4 U1.11(PF1/FSMC_A1/I2C2_SCL)
PF2: PF.5 U1.12(PF2/FSMC_A2/I2C2_SMBA)
PF3: PF.6 U1.13(PF3/FSMC_A3/ADC3_IN9)
PF4: PF.7 U1.14(PF4/FSMC_A4/ADC3_IN14)
PF5 [thin]: PF.8 U1.15(PF5/FSMC_A5/ADC3_IN15)
PF6/A1: CON2.2 PF6_E.1 U1.18(PF6/TIM10_CH1/FSMC_NIORD/ADC3_IN4) U4.A1
PF7/A2: CON2.3 PF7_E.2 U1.19(PF7/TIM11_CH1/FSMC_NREG/ADC3_IN5) U4.A2
PF9/A4: CON2.5 PF9_E.2 R42.1 U1.21(PF9/TIM14_CH1/FSMC_CD/ADC3_IN7) U4.A4
PF10/A5: CON2.6 PF10_E.1 R41.1 U1.22(PF10/FSMC_INTR/ADC3_IN8) U4.A5
PF11/USB_HS_FAULT: PF11_E.2 RM6.2.1 U1.49(PF11/DCMI_12) U7.3(FLAG_B)
PF12 [thin]: PF.15 U1.50(PF12/FSMC_A6)
PF13 [thin]: PF.16 U1.53(PF13/FSMC_A7)
PF14 [thin]: PF.17 U1.54(PF14/FSMC_A8)
PF15: PF.18 U1.55(PF15/FSMC_A9)
PG0 [thin]: PG.3 U1.56(PG0/FSMC_A10)
PG1 [thin]: PG.4 U1.57(PG1/FSMC_A11)
PG2: PG.5 U1.87(PG2/FSMC_A12)
PG3: PG.6 U1.88(PG3/FSMC_A13)
PG4 [thin]: PG.7 U1.89(PG4/FSMC_A14)
PG5 [thin]: PG.8 U1.90(PG5/FSMC_A15)
PG6: PG.9 U1.91(PG6/FSMC_INT2)
PG7/D6: CON3.7 PG7_E.2 U1.92(PG7/FSMC_INT3/USART6_CK) U4.D6
PG8/D7: CON3.8 PG8_E.1 U1.93(PG8/USART6_RTS/ETH_PPS_OUT) U4.D7
PG9: PG.12 U1.124(PG9/USART6_RX/FSMC_NE2/FSMC_NCE3)
PG10/UEXT_CS: R50.2 U1.125(PG10/FSMC_NCE4_1/FSMC_NE3) UEXT.10
PG11/ETH_RMII_TX_EN: R51.1 U1.126(PG11/FSMC_NCE4_2/ETH_MII_TX_EN) U3.16(TXEN)
PG12/D8: CON4.1 PG12_E.1 U1.127(PG12/FSMC_NE4/USART6_RTS) U4.D8
PG13/ETH_RMII_TXD0: R52.1 U1.128(PG13/FSMC_A24/USART6_CTS/ETH_MII_TXD0/ETH_RMII_TXD0) U3.17(TXD0)
PG14/ETH_RMII_TXD1: R53.2 U1.129(PG14/FSMC_A25/USART6_TX/ETH_MII_TXD1/ETH_RMII_TXD1) U3.18(TXD1)
PG15/D9: CON4.2 PG15_E.2 U1.132(PG15/USART6_CTS/DCMI_D13) U4.D9
PHY_RSTN: R28.2 R29.1(1.1) U3.48(RST#)
PHY_VDD_PLL: C35.1 C36.1 FB1.1 FB2.1 U3.47(VDDPLL)
RB7/D0/USART1_RX: CON3.1 U1.137(PB7/I2C1_SDA/FSMC_NL/DCMI_VSYNC/USART1_RX/TIM4_CH2) U4.D0
RB11/UART3_RX: BOOT.2 U1.70(PB11/I2C2_SDA/USART3_RX/OTG_HS_ULPI_D4/ETH_RMII_TX_EN/ETH_MII_TX_EN/OTG_HS_SDA/TIM2_CH4)
RF8/A3: CON2.4 PF8_E.1 U1.20(PF8/TIM13_CH1/FSMC_NIOWR/ADC3_IN6) U4.A3
RST: CON1.1 JTAG.15 R6.1 R29.2(1.2) R-T.2 U1.25(NRST) U4.RST
USB_OTG1_D+: U5.3 USB_OTG1.D+
USB_OTG1_D-: U5.1 USB_OTG1.D-
USB_OTG2_D+: U6.3 USB_OTG2.D+
USB_OTG2_D-: U6.1 USB_OTG2.D-
USB_SHIELD1: L4.2 USB_OTG2.GND1 USB_OTG2.GND2 USB_OTG2.GND3 USB_OTG2.GND4
USB_SHIELD2: L3.2 USB_OTG1.GND1 USB_OTG1.GND2 USB_OTG1.GND3 USB_OTG1.GND4
VBAT: D1.3(K) U1.6(VBAT)
VCC [PWR]: 3.3V_E.2 B0_1/B0_0.1 B1_1/B1_0.1 BOOT.4 C1.2 C2.2 C4.2 C5.2 C6.2 C7.2 C8.2 C9.2 C10.2 C11.2 C12.2 C13.2 C29.1 C34.1 C37.2 C38.2 C41.2 C47.2 CD1.4(VDD) CON1.2 D1.1(A1) JTAG.1 JTAG.2 L1.1 L2.1 LAN.AG LAN.AY PD.1 PE.1 PF.1 PG.1 R1.2(1.2) R5.2 R11.1 R18.1 R23.2 R27.1 R28.1 R30.1 R32.1 R33.2 R34.2 R35.2 R36.2 R37.2 R40.2 R41.2 R42.2 R60.1 RM1.1.2 RM1.2.2 RM1.3.2 RM1.4.2 RM2.3.1 RM4.1.2 RM4.3.2 RM4.4.2 RM6.2.2 RM6.3.2 U1.17(VDD_5) U1.30(VDD_12) U1.39(VDD_4) U1.52(VDD_6) U1.62(VDD_7) U1.72(VDD_1) U1.84(VDD_8) U1.95(VDD_9) U1.108(VDD_2) U1.121(VDD_10) U1.131(VDD_11) U1.144(VDD_SA) U2.2(VCC) U3.7(VDDIO1) U3.24(VDDIO2) U4.3V3 U5.5 U6.5 UEXT.1 WKUP.P$1 ; supply symbol labelled 3.3V
VCC/2: C26.1 C28.1 C30.2 C31.2 FB1.2 LAN.3(COM) R13.2 R14.2 R15.2 R16.2 R17.2 U3.31(VDDRX) U3.38(VDDRCV) U3.42(VDDTX) ; supply symbol labelled 2.5V
VREF+: C18.2 R3.2 U1.32(VREF+)
Unconnected: RM5.4.1 RM5.4.2 U3.10(RXC) U3.11(RXER/ISO) U3.29(LED3/NWAYEN) U3.34(FXSD/FXEN) U3.45(XO)

## Notes on the sheet
- FSMC_A10 | FSMC_D2
- FSMC_A11 | FSMC_D3
- FSMC_A12
- FSMC_A13 | FSMC_CLK
- FSMC_A14 | FSMC_NOE
- FSMC_A15 | FSMC_NWE
- FSMC_INT2 | FSMC_NWAIT
- FSMC_NE1
- FSMC_D13
- FSMC_NE2/FSMC_NCE3 | FSMC_D14
- FSMC_NCE4_1/FSMC_NCE3 | FSMC_D15
- FSMC_NCE4_2 | FSMC_A16
- FSMC_A17
- FSMC_A18
- FSMC_D0
- FSMC_D1
- FSMC_A0 | FSMC_NBL0
- FSMC_A1 | FSMC_NBL1
- FSMC_A2 | FSMC_A23
- FSMC_A3 | FSMC_A19
- FSMC_A4 | FSMC_A20
- FSMC_A5 | FSMC_A21
- FSMC_NIORD | FSMC_A22
- FSMC_NREG | FSMC_D4
- FSMC_NIOWR | FSMC_D5
- FSMC_CD | FSMC_D6
- FSMC_INTR | FSMC_D7
- FSMC_D8
- FSMC_A6 | FSMC_D9
- FSMC_A7 | FSMC_D10
- FSMC_A8 | FSMC_D11
- FSMC_A9 | FSMC_D12
- SD/MMC CARD
- UEXT
- LAN
- TUS VE LED
- JTAG
- USB_OTG1
- USB_OTG2
- 6-16VDC | STM32 REGÜLATOR 3.3v
- USART3_TX
- USART3_RX
- GND
- 3.3V

## Library data of the parts
3.3V_E AGND_E AREF_EN PE2_E PE4_E PE5_E PE6_E PF6_E PF7_E PF8_E PF9_E PF10_E PF11_E PG7_E PG8_E PG12_E PG15_E R-T = jumper:SJ: SMD solder JUMPER
3V_BAT = DOUBLE-SIDE:CON2: CONNECTORS - 2 PINS
B0_1/B0_0 B1_1/B1_0 = jumper:JP2E: JUMPER
BOOT = Penko:CON4
C1-C41 C43-C47 C49 C51-C55 C57-C60 C62 = rcl:C-EU: CAPACITOR, European symbol
C42 C48 C50 C56 C61 = rcl:CPOL-EU: POLARIZED CAPACITOR, European symbol
CD1 = gogo:6NC2_CLOCK_DRIVER
CON1 CON2 = Penko:CON6: CONNECTORS - 6 PINS
CON3 CON4 = Penko:CON8
D1 = semicon-smd-ipc:DIODE_AC-CA_: DUAL DIODE
D2 D3 = OLIMEX_DISCRET:MMBZ5V6ALT1
D4 = OLIMEX_DISCRET:SMBJ16A
FB1 FB2 L1-L6 = rcl:L-US: INDUCTOR, American symbol
GND_PIN = gogo:TESTPAD: drill 40mils, diameter 70mils
JTAG PD PE PF PG = con-harting-ml:ML20: HARTING
LAN = OLIMEX_CONNECTORS:RJLBC-060TC1
LED PWR_LED = DOUBLE-SIDE:LED
PWR_JACK = gogo:PWR-JAK
PWR_SEL = jumper:JP4Q: JUMPER
Q1 = crystal:HC49/S: CRYSTAL
Q2 = crystal:Q_GND
R1 R29 R43 R46 = OLIMEX_DISCRET:R_0R
R2-R28 R30-R42 R44 R45 R47-R60 = rcl:R-EU_: RESISTOR, European symbol
RESET WKUP = gogo:SW-TAKT
RM1-RM6 = OLIMEX_DISCRET:R_MATRIX_4E
SD/MMC = OLIMEX_CONNECTORS:MICRO_SD/MMC
U1 = OLIMEX_IC:STM32F207ZE: STM32F207ZE ARM-based 32-bit MCU, 150DMIPs, up to 1 MB Flash/128+4KB RAM,USB OTG HS/FS, Ethernet, 17 TIMs, 3 ADCs, 15 comm. interfaces & camera
U2 = gogo:RESET: Microcontroller Supervisory Circuit with Open Drain Output
U3 = OLIMEX_IC:KS8721BL: Ethernet PHY
U4 = OLIMEX_CASES:ARDUINO_SH_PLATFORM
U5 U6 = OLIMEX_IC:USBLC6-2
U7 = OLIMEX_IC:MIC2026: LM3526 Dual Port USB Power Switch and Over-Current Protection Features: -> Compatible with USB1.1 and USB2.0; -> 1 ms fault flag delay filters Hot-Plug events; -> Smooth turn-on eliminates in-rush induced voltage drop; -> UL recognized component: REF#205202; -> 1A nominal shortcircuit output current protects PC power supplies; -> Thermal shutdown protects device in direct short condition; -> 500mA minimum continuous load current; -> Small SO-8 package minimizes board space; -> 2.7V to 5.5V input voltage range; -> 140mOhm Max.switch resistance; -> 1 µA Max. standby current; -> 200µA Max. operating current; -> Under-voltage lockout(UVLO);
U8 = OLIMEX_IC:MP1482
U9 = OLIMEX_IC:SY8008
U$1 U$2 U$9 = SparkFunEagle-6-6-07:FIDUCIAL: Fiducial Alignment Points Various fiducial points for machine vision alignment.
UEXT = con-harting-ml:ML10: HARTING
USB_OTG1 USB_OTG2 = OLIMEX_CONNECTORS:MINI_USB9

## Net classes
1 PWR: width 0.203 mm, drill 0.4 mm, clearance 0.076 mm
2 thin: width 0.025 mm, clearance 0.025 mm
3 gsm_pwr: width 0.914 mm, drill 0.787 mm